# Altium schematic sheet Sheet2.SchDoc
size A4
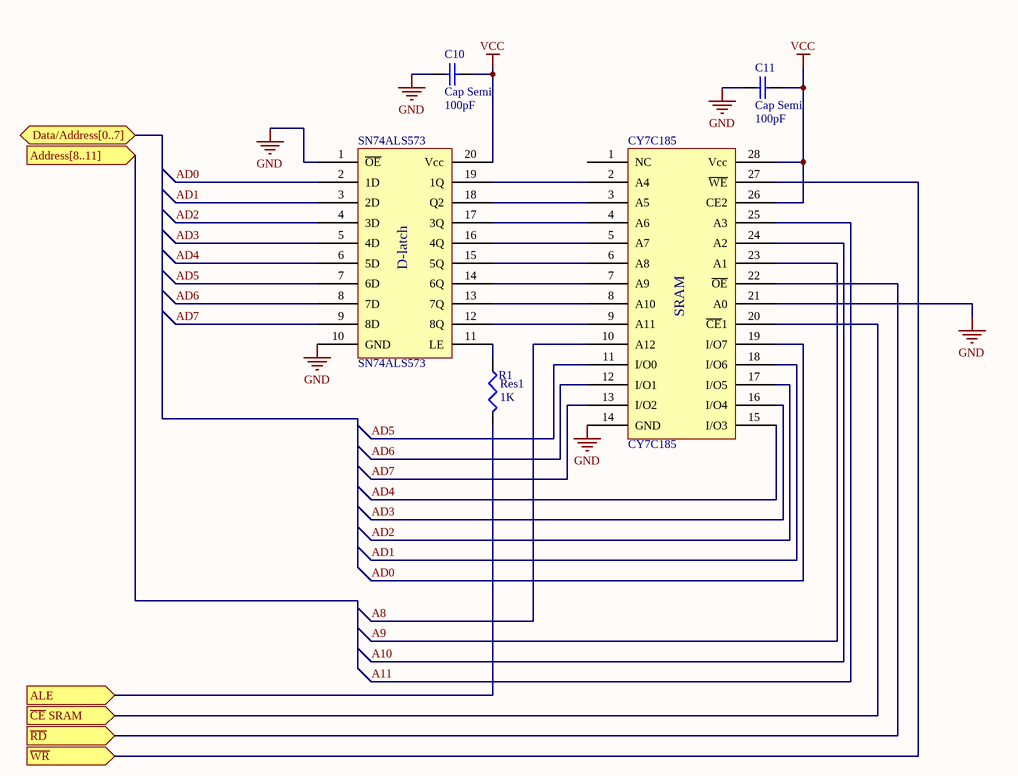
[diagram p0: Sheet2.SchDoc]

## Parts
C10  Cap Semi  value 100pF  [C1210]
C11  Cap Semi  value 100pF  [C1210]
CY7C185  CY7C185  [CY7C185 SOIC 28-PIN]
R1  Res1  value 1K  [14-1210]
SN74ALS573  SN74ALS573  [D-Latch SOIC 20-PIN]

## Ports
Address[8..11] (in), ALE (in), Data/Address[0..7] (bidir), ~{CE} SRAM (in), ~{RD} (in), ~{WR} (in)

## Nets
GND: C10.2 C11.2 CY7C185.14(GND) CY7C185.21(A0) SN74ALS573.1(~{OE}) SN74ALS573.10(GND)
VCC: C10.1 C11.1 CY7C185.26(CE2) CY7C185.28(Vcc) SN74ALS573.20(Vcc)
A8: CY7C185.10(A12)
A9: CY7C185.23(A1)
A10: CY7C185.24(A2)
A11: CY7C185.25(A3)
AD0: CY7C185.19(I/O7) SN74ALS573.2(1D)
AD1: CY7C185.18(I/O6) SN74ALS573.3(2D)
AD2: CY7C185.17(I/O5) SN74ALS573.4(3D)
AD3: CY7C185.16(I/O4) SN74ALS573.5(4D)
AD4: CY7C185.15(I/O3) SN74ALS573.6(5D)
AD5: CY7C185.11(I/O0) SN74ALS573.7(6D)
AD6: CY7C185.12(I/O1) SN74ALS573.8(7D)
AD7: CY7C185.13(I/O2) SN74ALS573.9(8D)
ALE: R1.2 ; port ALE
~{CE} SRAM: CY7C185.20(~{CE}1) ; port ~{CE} SRAM
~{RD}: CY7C185.22(~{OE}) ; port ~{RD}
~{WR}: CY7C185.27(~{WE}) ; port ~{WR}
NetCY7C185_2: CY7C185.2(A4) SN74ALS573.19(1Q)
NetCY7C185_3: CY7C185.3(A5) SN74ALS573.18(Q2)
NetCY7C185_4: CY7C185.4(A6) SN74ALS573.17(3Q)
NetCY7C185_5: CY7C185.5(A7) SN74ALS573.16(4Q)
NetCY7C185_6: CY7C185.6(A8) SN74ALS573.15(5Q)
NetCY7C185_7: CY7C185.7(A9) SN74ALS573.14(6Q)
NetCY7C185_8: CY7C185.8(A10) SN74ALS573.13(7Q)
NetCY7C185_9: CY7C185.9(A11) SN74ALS573.12(8Q)
NetR1_1: R1.1 SN74ALS573.11(LE)

Not connected (* = marked no-connect by the designer): CY7C185 1(NC)

## Notes on the sheet
- (in symbol CY7C185) SRAM
- (in symbol SN74ALS573) D-latch

## Library data of the parts
C10 C11 = Cap Semi: Capacitor (Semiconductor SIM Model); Published: 8-Jun-2000; LatestRevisionDate: 29-May-2009; LatestRevisionNote: IPC-7351 Footprint Added.; PackageReference: C1206; Publisher: Altium Limited; PackageDescription: Chip Capacitor
CY7C185 = CY7C185: SRAM - Static Random Access Memory
R1 = Res3: Resistor; Published: 8-Jun-2000; LatestRevisionDate: 29-May-2009; LatestRevisionNote: IPC-7351 Footprint Added.; PackageReference: J1-0603; Publisher: Altium Limited; PackageDescription: Chip Resistor
SN74ALS573 = SN74ALS573: D-Latch